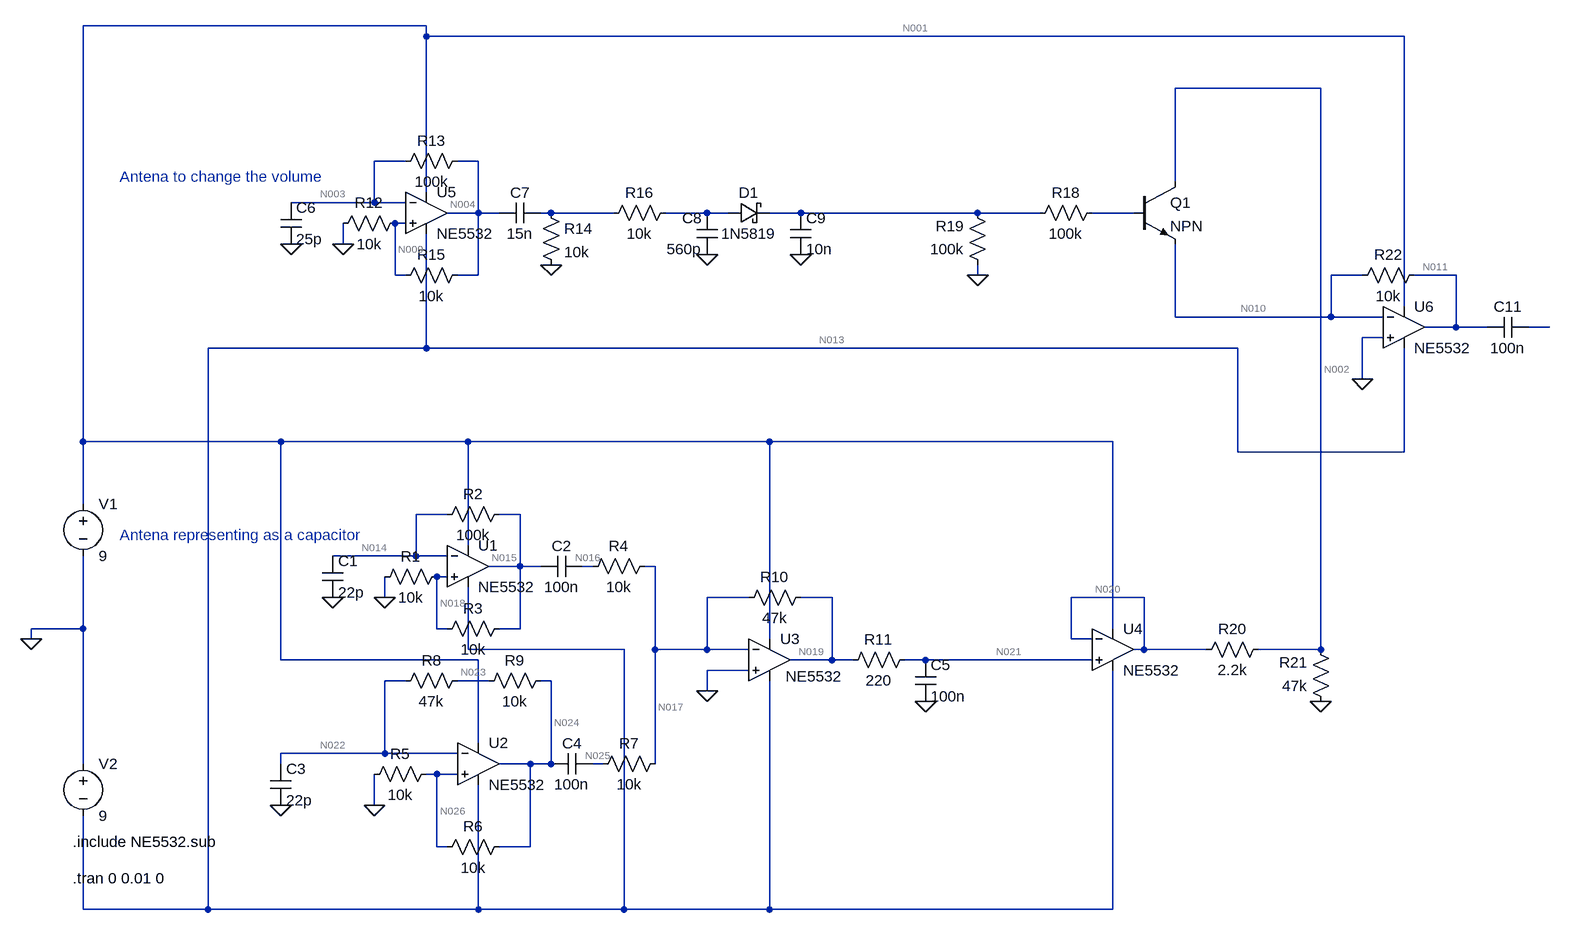
[diagram p0: schematic Theramin Circuit.asc]
Theramin Circuit.asc, the LTspice schematic file:
Version 4
SHEET 1 1972 1280
WIRE 144 -656 -384 -656
WIRE 144 -640 144 -656
WIRE 1648 -640 144 -640
WIRE 1520 -560 1296 -560
WIRE 112 -448 64 -448
WIRE 224 -448 192 -448
WIRE 1296 -416 1296 -560
WIRE 144 -400 144 -640
WIRE 64 -384 64 -448
WIRE 64 -384 -64 -384
WIRE 112 -384 64 -384
WIRE 224 -368 224 -448
WIRE 224 -368 176 -368
WIRE 256 -368 224 -368
WIRE 336 -368 320 -368
WIRE 432 -368 336 -368
WIRE 576 -368 512 -368
WIRE 608 -368 576 -368
WIRE 720 -368 672 -368
WIRE 992 -368 720 -368
WIRE 1088 -368 992 -368
WIRE 1232 -368 1168 -368
WIRE 112 -352 96 -352
WIRE 16 -320 16 -352
WIRE 96 -272 96 -352
WIRE 112 -272 96 -272
WIRE 224 -272 224 -368
WIRE 224 -272 192 -272
WIRE 992 -272 992 -288
WIRE 1584 -272 1536 -272
WIRE 1728 -272 1664 -272
WIRE 1648 -224 1648 -640
WIRE 1296 -208 1296 -320
WIRE 1536 -208 1536 -272
WIRE 1536 -208 1296 -208
WIRE 1616 -208 1536 -208
WIRE 1728 -192 1728 -272
WIRE 1728 -192 1680 -192
WIRE 1776 -192 1728 -192
WIRE 1872 -192 1840 -192
WIRE 1616 -176 1584 -176
WIRE 144 -160 144 -336
WIRE 144 -160 -192 -160
WIRE 1392 -160 144 -160
WIRE 1584 -112 1584 -176
WIRE -384 -16 -384 -656
WIRE -80 -16 -384 -16
WIRE 208 -16 -80 -16
WIRE 672 -16 208 -16
WIRE 1200 -16 672 -16
WIRE 1392 0 1392 -160
WIRE 1648 0 1648 -160
WIRE 1648 0 1392 0
WIRE -384 80 -384 -16
WIRE 176 96 128 96
WIRE 288 96 256 96
WIRE 208 144 208 -16
WIRE 128 160 128 96
WIRE 128 160 0 160
WIRE 176 160 128 160
WIRE 288 176 288 96
WIRE 288 176 240 176
WIRE 320 176 288 176
WIRE 400 176 384 176
WIRE 496 176 480 176
WIRE 176 192 160 192
WIRE 80 224 80 192
WIRE 640 224 576 224
WIRE 768 224 720 224
WIRE 1248 224 1136 224
WIRE -384 272 -384 160
WIRE -384 272 -464 272
WIRE 160 272 160 192
WIRE 176 272 160 272
WIRE 288 272 288 176
WIRE 288 272 256 272
WIRE 1200 272 1200 -16
WIRE -464 288 -464 272
WIRE 672 288 672 -16
WIRE 1136 288 1136 224
WIRE 1168 288 1136 288
WIRE 208 304 208 208
WIRE 448 304 208 304
WIRE 496 304 496 176
WIRE 576 304 576 224
WIRE 576 304 496 304
WIRE 640 304 576 304
WIRE 1248 304 1248 224
WIRE 1248 304 1232 304
WIRE 1344 304 1248 304
WIRE 1520 304 1520 -560
WIRE 1520 304 1424 304
WIRE -80 320 -80 -16
WIRE 224 320 -80 320
WIRE 768 320 768 224
WIRE 768 320 704 320
WIRE 800 320 768 320
WIRE 912 320 880 320
WIRE 1168 320 912 320
WIRE 640 336 576 336
WIRE 112 352 80 352
WIRE 240 352 192 352
WIRE 336 352 320 352
WIRE 576 368 576 336
WIRE 224 448 224 320
WIRE 80 464 80 352
WIRE 80 464 -80 464
WIRE 192 464 80 464
WIRE -384 480 -384 272
WIRE -80 480 -80 464
WIRE 304 480 256 480
WIRE 336 480 336 352
WIRE 336 480 304 480
WIRE 416 480 400 480
WIRE 496 480 496 304
WIRE 160 496 144 496
WIRE 192 496 160 496
WIRE 64 544 64 496
WIRE 160 608 160 496
WIRE 176 608 160 608
WIRE 304 608 304 480
WIRE 304 608 256 608
WIRE -384 704 -384 560
WIRE -192 704 -192 -160
WIRE -192 704 -384 704
WIRE 224 704 224 512
WIRE 224 704 -192 704
WIRE 448 704 448 304
WIRE 448 704 224 704
WIRE 672 704 672 352
WIRE 672 704 448 704
WIRE 1200 704 1200 336
WIRE 1200 704 672 704
FLAG 0 224 0
FLAG 80 224 0
FLAG -80 544 0
FLAG 64 544 0
FLAG 576 368 0
FLAG 912 384 0
FLAG -464 288 0
FLAG -64 -320 0
FLAG 16 -320 0
FLAG 336 -288 0
FLAG 576 -304 0
FLAG 720 -304 0
FLAG 992 -272 0
FLAG 1520 384 0
FLAG 1584 -112 0
SYMBOL OpAmps\\opamp2 208 112 R0
SYMATTR InstName U1
SYMATTR Value NE5532
SYMBOL OpAmps\\opamp2 224 416 R0
SYMATTR InstName U2
SYMATTR Value NE5532
SYMBOL OpAmps\\opamp2 672 256 R0
WINDOW 3 25 89 Left 2
SYMATTR Value NE5532
SYMATTR InstName U3
SYMBOL cap -16 160 R0
SYMATTR InstName C1
SYMATTR Value 22p
SYMBOL res 176 176 R90
WINDOW 0 0 56 VBottom 2
WINDOW 3 32 56 VTop 2
SYMATTR InstName R1
SYMATTR Value 10k
SYMBOL res 272 80 R90
WINDOW 0 0 56 VBottom 2
WINDOW 3 32 56 VTop 2
SYMATTR InstName R2
SYMATTR Value 100k
SYMBOL res 272 256 R90
WINDOW 0 0 56 VBottom 2
WINDOW 3 32 56 VTop 2
SYMATTR InstName R3
SYMATTR Value 10k
SYMBOL res 496 160 R90
WINDOW 0 0 56 VBottom 2
WINDOW 3 32 56 VTop 2
SYMATTR InstName R4
SYMATTR Value 10k
SYMBOL cap 384 160 R90
WINDOW 0 0 32 VBottom 2
WINDOW 3 32 32 VTop 2
SYMATTR InstName C2
SYMATTR Value 100n
SYMBOL res 160 480 R90
WINDOW 0 0 56 VBottom 2
WINDOW 3 32 56 VTop 2
SYMATTR InstName R5
SYMATTR Value 10k
SYMBOL res 272 592 R90
WINDOW 0 0 56 VBottom 2
WINDOW 3 32 56 VTop 2
SYMATTR InstName R6
SYMATTR Value 10k
SYMBOL cap -96 480 R0
SYMATTR InstName C3
SYMATTR Value 22p
SYMBOL cap 400 464 R90
WINDOW 0 0 32 VBottom 2
WINDOW 3 32 32 VTop 2
SYMATTR InstName C4
SYMATTR Value 100n
SYMBOL res 512 464 R90
WINDOW 0 0 56 VBottom 2
WINDOW 3 32 56 VTop 2
SYMATTR InstName R7
SYMATTR Value 10k
SYMBOL res 208 336 R90
WINDOW 0 0 56 VBottom 2
WINDOW 3 32 56 VTop 2
SYMATTR InstName R8
SYMATTR Value 47k
SYMBOL res 336 336 R90
WINDOW 0 0 56 VBottom 2
WINDOW 3 32 56 VTop 2
SYMATTR InstName R9
SYMATTR Value 10k
SYMBOL res 736 208 R90
WINDOW 0 0 56 VBottom 2
WINDOW 3 32 56 VTop 2
SYMATTR InstName R10
SYMATTR Value 47k
SYMBOL res 896 304 R90
WINDOW 0 0 56 VBottom 2
WINDOW 3 32 56 VTop 2
SYMATTR InstName R11
SYMATTR Value 220
SYMBOL cap 896 320 R0
SYMATTR InstName C5
SYMATTR Value 100n
SYMBOL OpAmps\\opamp2 1200 240 R0
SYMATTR InstName U4
SYMATTR Value NE5532
SYMBOL voltage -384 64 R0
WINDOW 123 0 0 Left 0
WINDOW 39 0 0 Left 0
SYMATTR InstName V1
SYMATTR Value 9
SYMBOL voltage -384 464 R0
WINDOW 123 0 0 Left 0
WINDOW 39 0 0 Left 0
SYMATTR InstName V2
SYMATTR Value 9
SYMBOL OpAmps\\opamp2 144 -432 R0
SYMATTR InstName U5
SYMATTR Value NE5532
SYMBOL cap -80 -384 R0
SYMATTR InstName C6
SYMATTR Value 25p
SYMBOL res 112 -368 R90
WINDOW 0 0 56 VBottom 2
WINDOW 3 32 56 VTop 2
SYMATTR InstName R12
SYMATTR Value 10k
SYMBOL res 208 -464 R90
WINDOW 0 0 56 VBottom 2
WINDOW 3 32 56 VTop 2
SYMATTR InstName R13
SYMATTR Value 100k
SYMBOL cap 320 -384 R90
WINDOW 0 0 32 VBottom 2
WINDOW 3 32 32 VTop 2
SYMATTR InstName C7
SYMATTR Value 15n
SYMBOL res 208 -288 R90
WINDOW 0 0 56 VBottom 2
WINDOW 3 32 56 VTop 2
SYMATTR InstName R15
SYMATTR Value 10k
SYMBOL res 320 -384 R0
SYMATTR InstName R14
SYMATTR Value 10k
SYMBOL res 528 -384 R90
WINDOW 0 0 56 VBottom 2
WINDOW 3 32 56 VTop 2
SYMATTR InstName R16
SYMATTR Value 10k
SYMBOL cap 592 -304 R180
WINDOW 0 24 56 Left 2
WINDOW 3 24 8 Left 2
SYMATTR InstName C8
SYMATTR Value 560p
SYMBOL schottky 608 -352 R270
WINDOW 0 32 32 VTop 2
WINDOW 3 0 32 VBottom 2
SYMATTR InstName D1
SYMATTR Value 1N5819
SYMATTR Description Diode
SYMATTR Type diode
SYMBOL cap 704 -368 R0
SYMATTR InstName C9
SYMATTR Value 10n
SYMBOL res 1184 -384 R90
WINDOW 0 0 56 VBottom 2
WINDOW 3 32 56 VTop 2
SYMATTR InstName R18
SYMATTR Value 100k
SYMBOL res 1008 -272 R180
WINDOW 0 36 76 Left 2
WINDOW 3 36 40 Left 2
SYMATTR InstName R19
SYMATTR Value 100k
SYMBOL npn 1232 -416 R0
SYMATTR InstName Q1
SYMBOL res 1440 288 R90
WINDOW 0 0 56 VBottom 2
WINDOW 3 32 56 VTop 2
SYMATTR InstName R20
SYMATTR Value 2.2k
SYMBOL res 1536 400 R180
WINDOW 0 36 76 Left 2
WINDOW 3 36 40 Left 2
SYMATTR InstName R21
SYMATTR Value 47k
SYMBOL OpAmps\\opamp2 1648 -256 R0
SYMATTR InstName U6
SYMATTR Value NE5532
SYMBOL res 1680 -288 R90
WINDOW 0 0 56 VBottom 2
WINDOW 3 32 56 VTop 2
SYMATTR InstName R22
SYMATTR Value 10k
SYMBOL cap 1840 -208 R90
WINDOW 0 0 32 VBottom 2
WINDOW 3 32 32 VTop 2
SYMATTR InstName C11
SYMATTR Value 100n
TEXT -400 600 Left 2 !.include NE5532.sub
TEXT -328 128 Left 2 ;Antena representing as a capacitor
TEXT -400 656 Left 2 !.tran 0 0.01 0
TEXT -328 -424 Left 2 ;Antena to change the volume

The netlist it stands for:
* Theramin Circuit.asc
XU1 N018 N014 N001 N013 N015 NE5532  ; pins In+ In- V+ V- OUT
XU2 N026 N022 N001 N013 N024 NE5532  ; pins In+ In- V+ V- OUT
XU3 0 N017 N001 N013 N019 NE5532  ; pins In+ In- V+ V- OUT
C1 N014 0 22p
R1 N018 0 10k
R2 N015 N014 100k
R3 N015 N018 10k
R4 N017 N016 10k
C2 N016 N015 100n
R5 N026 0 10k
R6 N024 N026 10k
C3 N022 0 22p
C4 N025 N024 100n
R7 N017 N025 10k
R8 N023 N022 47k
R9 N024 N023 10k
R10 N019 N017 47k
R11 N021 N019 220
C5 N021 0 100n
XU4 N021 N020 N001 N013 N020 NE5532  ; pins In+ In- V+ V- OUT
V1 N001 0 9
V2 0 N013 9
XU5 N009 N003 N001 N013 N004 NE5532  ; pins In+ In- V+ V- OUT
C6 N003 0 25p
R12 N009 0 10k
R13 N004 N003 100k
C7 N005 N004 15n
R15 N004 N009 10k
R14 N005 0 10k
R16 N006 N005 10k
C8 0 N006 560p
D1 N006 N007 1N5819
C9 N007 0 10n
R18 N008 N007 100k
R19 0 N007 100k
Q1 N002 N008 N010 0 NPN
R20 N002 N020 2.2k
R21 0 N002 47k
XU6 0 N010 N001 N013 N011 NE5532  ; pins In+ In- V+ V- OUT
R22 N011 N010 10k
C11 N012 N011 100n
.model D D
.lib standard.dio
.model NPN NPN
.model PNP PNP
.lib standard.bjt
.include NE5532.sub
* Antena representing as a capacitor
.tran 0 0.01 0
* Antena to change the volume
.backanno
.end

* Results of the author's LTspice run, read from the files saved beside the schematic
* Operating Point, zero values left out:
*   V(n015) = 94.72 mV
*   V(n013) = -9 V
*   V(n001) = 9 V
*   V(n014) = 44.87 mV
*   V(n018) = 44.87 mV
*   V(n024) = 51.85 mV
*   V(n022) = 23.44 mV
*   V(n026) = 23.43 mV
*   V(n019) = 23.43 mV
*   V(n017) = 6.496 µV
*   V(n016) = 6.496 µV
*   V(n025) = 6.496 µV
*   V(n023) = 46.86 mV
*   V(n021) = 23.32 mV
*   V(n020) = 23.33 mV
*   V(n004) = 94.72 mV
*   V(n003) = 44.87 mV
*   V(n009) = 44.87 mV
*   V(n002) = 22.28 mV
*   V(n010) = 6.681 µV
*   V(n011) = 4.99 mV
*   I(R22) = 498.3 nA
*   I(R21) = -474.1 nA
*   I(R20) = -474.1 nA
*   I(R15) = 4.985 µA
*   I(R13) = 498.5 nA
*   I(R12) = 4.487 µA
*   I(R11) = -498.3 nA
*   I(R10) = 498.3 nA
*   I(R9) = 498.4 nA
*   I(R8) = 498.4 nA
*   I(R6) = 2.841 µA
*   I(R5) = 2.343 µA
*   I(R3) = 4.985 µA
*   I(R2) = 498.5 nA
*   I(R1) = 4.487 µA
*   I(V2) = -14.72 mA
*   I(V1) = -14.71 mA